# Altium project Mạch khuếch đại âm tần.PrjPcb
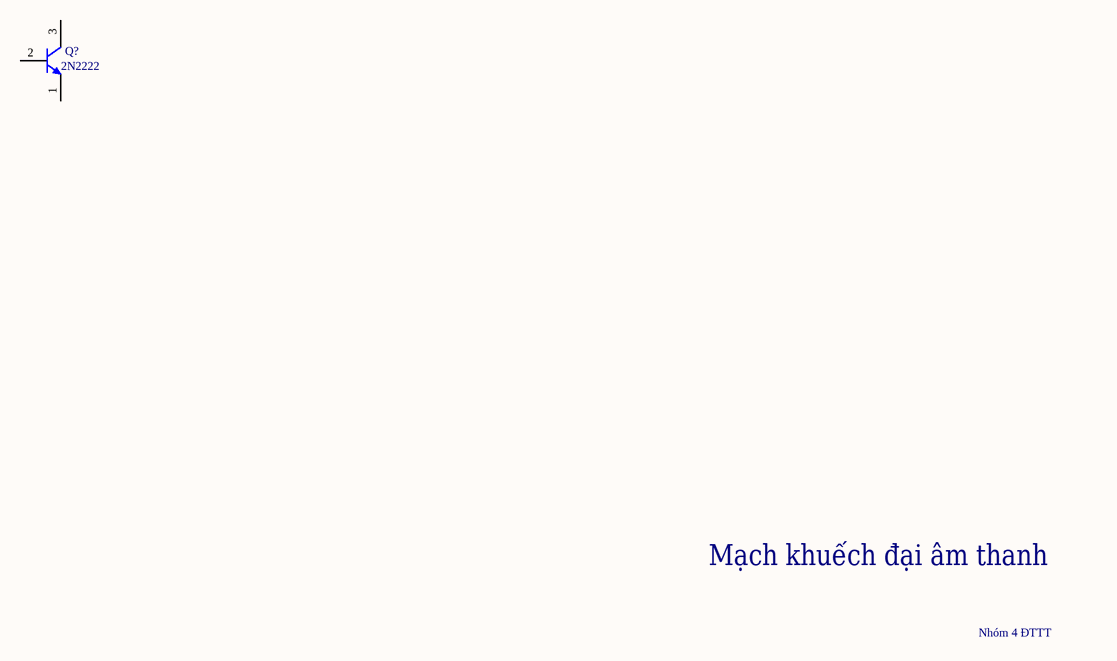
[diagram p0: Sheet1.SchDoc]
1 sheet, 1 parts. Net scope: global (net labels, ports and power ports of the same name join across sheets).
Board file: PCB1.PcbDoc

## Sheet Sheet1.SchDoc
size A4; SheetNumber: 1; SheetTotal: 1

### Parts
Q?  2N2222  [MLTC-TO-18-3]

### Nets

Not connected (* = marked no-connect by the designer): Q? 1(E) 2(B) 3(C)

### Notes on the sheet
- Mạch khuếch đại âm thanh
- Nhóm 4 ĐTTT

### Library data of the parts
Q? = CMP-2000-05237-1: Low Power Bipolar NPN Transistor, 30 V, -65 to 200 degC, 3-Pin TO-18, RoHS, Bulk; Manufacturer: Multicomp; Pin Configuration: a; No. of Pins: 3; No. of Transistors: 1; Collector Emitter Voltage Vces: 400mV; Current Ic Continuous a Max: 800mA; Power Dissipation Pd: 500mW; Collector Emitter Voltage V(br)ceo: 30V; Gain Bandwidth ft Typ: 250MHz; Voltage Vcbo: 60V; DC Current Gain hFE: 100; Full Power Rating Temperature: 25degC; Current Ic @ Vce Sat: 150mA; SVHC: NoSVHC(19-Dec-2012); Package Reference: TO-18-3; Package Description: 3-Pin Transistor Outline Package (TO-18), Dia 5.54 mm, Pitch Pitch 1.485mm; Datasheet URL: http://www.farnell.com/datasheets/1662272.pdf; Transistor Case Style: TO-18; Continuous Collector Current Ic Max: 800mA; Manufacturer URL: http://uk.farnell.com/b/multicomp; DC Collector Current: 800mA; Hfe Min: 100; Transistor Polarity: NPN; Power Dissipation Ptot Max: 500mW; Package / Case: TO-18; Datasheet Version: Rev. 1.1, 05/2012; Gain Bandwidth ft Min: 250MHz; Current Ic hFE: 150mA